# Altium schematic sheet Schema1.SchDoc: Olimex interface board
size A4; DrawnBy: Coen de Boer; Engineer: Coen de Boer; Revision: 2005-H; SheetNumber: 1
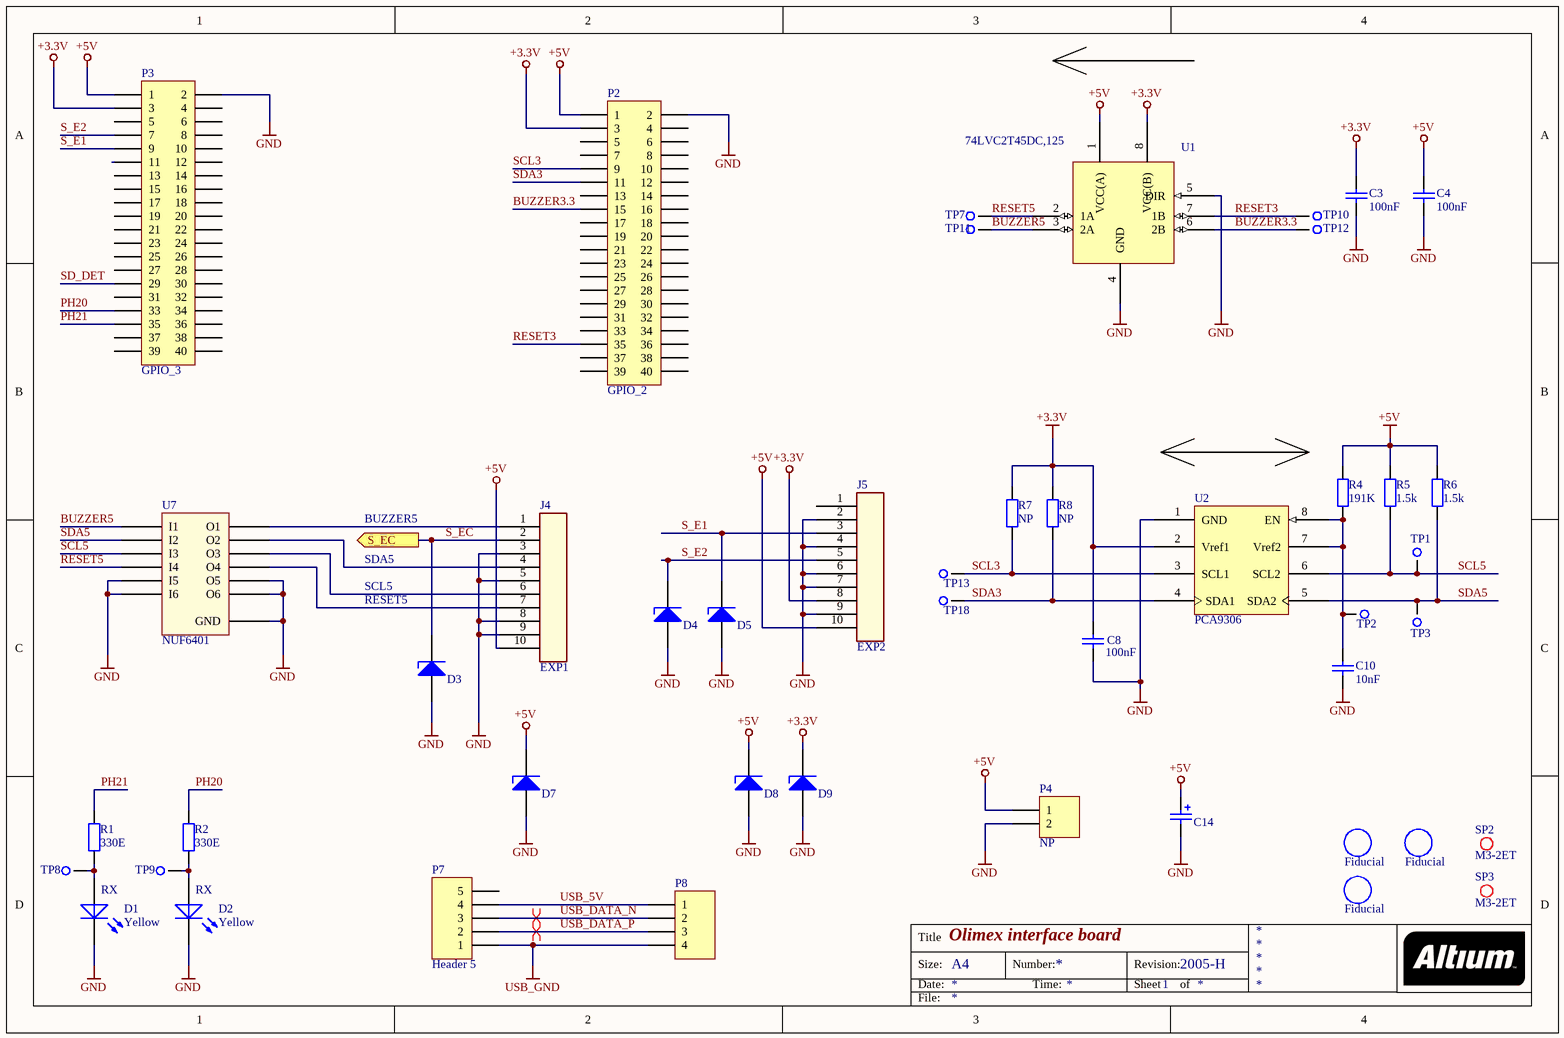
[diagram p0: Schema1.SchDoc]

## Parts
C3  100nF  [C0805 (2012)]
C4  100nF  [C0805 (2012)]
C8  100nF  [C0805 (2012)]
C10  10nF  [C0805 (2012)]
C14  470u  [CAPAE7866X80M]  (value not drawn)
D1  Yellow  [LED0805-YELLOW]
D2  Yellow  [LED0805-YELLOW]
D3  ESD9X3.3ST5G  [SODFL100X40-2N]  (value not drawn)
D4  ESD9X3.3ST5G  [SODFL100X40-2N]  (value not drawn)
D5  ESD9X3.3ST5G  [SODFL100X40-2N]  (value not drawn)
D7  ESD9X5.0ST5G  [SODFL100X40-2N]  (value not drawn)
D8  ESD9X5.0ST5G  [SODFL100X40-2N]  (value not drawn)
D9  ESD9X3.3ST5G  [SODFL100X40-2N]  (value not drawn)
Fid1  Fiducial  [Fiducial 1,5mm]  (no BOM)
Fid2  Fiducial  [Fiducial 1,5mm]  (no BOM)
Fid3  Fiducial  [Fiducial 1,5mm]  (no BOM)
J4  EXP1  [BOXHEADER-10P-R/A-ST-2.54]
J5  EXP2  [BOXHEADER-10P-R/A-ST-2.54]
P2  GPIO_2  [M50-3152042]
P3  GPIO_3  [M50-3152042]
P4  NP  [HDR1X2]
P7  Header 5  [Female Header 5 pins]
P8  (no value)  [B4B-XH-A]
R1  330E  [RESC1608X05N]
R2  330E  [RESC1608X05N]
R4  191K  [R0805 (2012)]
R5  1.5k  [RESC1608X05N]
R6  1.5k  [RESC1608X05N]
R7  NP  [R0805 (2012)]
R8  NP  [R0805 (2012)]
SP2  M3-2ET  [SPACER M3-4ET]
SP3  M3-2ET  [Spacer M3-4ETkleinepad]
TP1  2mm  [TESTPOINT 2mm]  (value not drawn)  (no BOM)
TP2  2mm  [TESTPOINT 2mm]  (value not drawn)  (no BOM)
TP3  2mm  [TESTPOINT 2mm]  (value not drawn)  (no BOM)
TP7  2mm  [TESTPOINT 2mm]  (value not drawn)  (no BOM)
TP8  2mm  [TESTPOINT 2mm]  (value not drawn)  (no BOM)
TP9  2mm  [TESTPOINT 2mm]  (value not drawn)  (no BOM)
TP10  2mm  [TESTPOINT 2mm]  (value not drawn)  (no BOM)
TP11  2mm  [TESTPOINT 2mm]  (value not drawn)  (no BOM)
TP12  2mm  [TESTPOINT 2mm]  (value not drawn)  (no BOM)
TP13  2mm  [TESTPOINT 2mm]  (value not drawn)  (no BOM)
TP18  2mm  [TESTPOINT 2mm]  (value not drawn)  (no BOM)
U1  74LVC2T45DC,125  [TSSOP50P310X100-8N]
U2  PCA9306  [IC SSOP-8]
U7  NUF6401  [SON50P140X100_HS-13N]

## Ports
S_EC (out)

## Nets
+3.3V: C3.1 C8.2 D9.1(K) J5.8 P2.3 P3.3 R7.2 R8.2 U1.8(VCC(B)) U2.2(Vref1)
+5V: C4.1 C14.1 D7.1(K) D8.1(K) J4.10 J5.10 P2.1 P3.1 P4.1 R4.2 R5.2 R6.2 U1.1(VCC(A))
GND: C3.2 C4.2 C8.1 C10.1 C14.2 D1.2(K) D2.2(K) D3.2(A) D4.2(A) D5.2(A) D7.2(A) D8.2(A) D9.2(A) J4.3 J4.5 J4.8 J4.9 J5.2 J5.4 J5.6 J5.7 J5.9 P2.2 P3.2 P4.2 U1.4(GND) U1.5(DIR) U2.1(GND) U7.5(I5) U7.6(I6) U7.7(O6) U7.8(O5) U7.13(GND)
USB_GND: P7.1 P8.4
BUZZER3.3: P2.15 TP12.1 U1.6(2B)
BUZZER5: TP11.1 U1.3(2A) U7.1(I1)
PH20: P3.33 R2.2
PH21: P3.35 R1.2
RESET3: P2.35 TP10.1 U1.7(1B)
RESET5: TP7.1 U1.2(1A) U7.4(I4)
S_E1: D5.1(K) J5.3 P3.9
S_E2: D4.1(K) J5.5 P3.7
S_EC: D3.1(K) J4.2 ; port S_EC
SCL3: P2.9 R7.1 TP13.1 U2.3(SCL1)
SCL5: R5.1 TP1.1 U2.6(SCL2) U7.3(I3)
SD_DET: P3.29
SDA3: P2.11 R8.1 TP18.1 U2.4(SDA1)
SDA5: R6.1 TP3.1 U2.5(SDA2) U7.2(I2)
USB_5V: P7.4 P8.1
USB_DATA_N: P7.3 P8.2
USB_DATA_P: P7.2 P8.3
NetC10_2: C10.2 R4.1 TP2.1 U2.7(Vref2) U2.8(EN)
NetD1_1: D1.1(A) R1.1 TP8.1
NetD2_1: D2.1(A) R2.1 TP9.1
NetJ4_1: J4.1 U7.12(O1)
NetJ4_4: J4.4 U7.11(O2)
NetJ4_6: J4.6 U7.10(O3)
NetJ4_7: J4.7 U7.9(O4)

Not connected (* = marked no-connect by the designer): J5 1; P2 4 5 6 7 8 10 12 13 14 16 17 18 19 20 21 22 23 24 25 26 27 28 29 30 31 32 33 34 36 37 38 39 40; P3 4 5 6 8 10 11 12 13 14 15 16 17 18 19 20 21 22 23 24 25 26 27 28 30 31 32 34 36 37 38 39 40; P7 5

## Layout directives
differential pair: USB_DATA_N, USB_DATA_P

## Notes on the sheet
- BUZZER5
- SDA5
- SCL5
- RESET5
- (near D1) RX
- (near D2) RX
- Title
- Size:
- Date:
- A4
- Number:
- Time:
- Revision:
- Sheet
- of
- File:

## Library data of the parts
C3 C4 C8 = Cap 100nF X7R 0805: Cap 100nF X7R 0805 10% 100V; Mfg: AVX; Mfg code: 08051C104K4T2A; Faber ItemCode: -; Max soldering temp: -; Remarks: -; Supplier: Farnell; Supplier code: 1833888; Value: 100nF; SMD: Yes
C10 = Cap 10nF X7R 0805: Cap 10nF X7R 0805 10% 100V; Mfg: AVX; Mfg code: 08051C103K4Z2A; Faber ItemCode: -; Max soldering temp: -; Remarks: -; Supplier: Farnell; Supplier code: 1833850; SMD: Yes; Value: 10nF
C14 = CAP ALUM 470UF 20% 10V SMD: Mfg: Panasonic Electronic Components; Mfg code: EEE-FTA471XAP; Capacitance: 470µF; ESR (Equivalent Series Resistance): 160 mohm @ 100kHz; Lifetime @ Temp.: 2000 Hrs @ 105°C; Polarization: Polar; Ripple Current: 390mA @ 120Hz; Surface Mount Land Size: 0.260" L x 0.260" W (6.60mm x 6.60mm); Supplier 1: Digi-Key; Supplier Part Number 1: P15094TR-ND; RoHS: RoHS Compliant; Category: Capacitors; Stock: 31500; Pricing: 900=0.22154, 1800=0.20851, 2700=0.19548, 4500=0.18244, 9000=0.17593, 22500=0.17332, 45000=0.16941, 90000=0.16615 (EUR); Packaging: Tape & Reel (TR); Tolerance: ±20%; Voltage Rating: 10V; Operating Temperature: -55°C ~ 105°C; Applications: General Purpose; Impedance: -; Lead Spacing: -; Size / Dimension: 0.248" Dia (6.30mm); Height - Seated (Max): 0.315" (8.00mm); Mounting Type: Surface Mount; Package / Case: Radial, Can - SMD; ComponentLink1URL: http://industrial.panasonic.com/cdbs/www-data/pdf/RDE0000/ABA0000C35.pdf; ComponentLink1Description: http://industrial.panasonic.com/cdbs/www-data/pdf/RDE0000/ABA0000C35.pdf
D1 D2 = Library_LED-0003: RO LED GEEL HSMY-C170 0805  AVAGO; Faber ItemCode: 35160800; ID: Library_LED-0003; Mfg: AVAGO; Mfg code: HSMY-C170; Value: Yellow
D3-D5 D9 = ESD9X3.3ST5G: TVS DIODE 3.3VWM 10.4VC SOD923; Mfg: ON Semiconductor; Type: Zener; Unidirectional Channels: 1; Voltage - Reverse Standoff (Typ): 3.3V (Max); Voltage - Breakdown (Min): 5V; Voltage - Clamping (Max) @ Ipp: 10.4V; Current - Peak Pulse (10/1000µs): 9.8A (8/20µs); Power - Peak Pulse: 102W; Power Line Protection: No; Capacitance @ Frequency: 80pF @ 1MHz; Supplier 1: Digi-Key; Supplier Part Number 1: ESD9X3.3ST5GOSTR-ND; Mfg code: ESD9X3.3ST5G; RoHS: RoHS Compliant; Category: Circuit Protection; Stock: 136000; Pricing: 8000=0.03287, 16000=0.02794, 24000=0.02629, 56000=0.02465, 200000=0.02136 (EUR); Packaging: Tape & Reel (TR); Bidirectional Channels: -; Applications: Automotive; Operating Temperature: -55°C ~ 150°C (TJ); Mounting Type: Surface Mount; Package / Case: SOD-923; Supplier Device Package: SOD-923; ComponentLink1URL: http://www.onsemi.com/pub_link/Collateral/ESD9X3.3ST5G-D.PDF; ComponentLink1Description: http://www.onsemi.com/pub_link/Collateral/ESD9X3.3ST5G-D.PDF
D7 D8 = ESD9X5.0ST5G: TVS DIODE 5VWM 12.3VC SOD923; Mfg: ON Semiconductor; Type: Zener; Unidirectional Channels: 1; Voltage - Reverse Standoff (Typ): 5V (Max); Voltage - Breakdown (Min): 6.2V; Voltage - Clamping (Max) @ Ipp: 12.3V; Current - Peak Pulse (10/1000µs): 8.7A (8/20µs); Power - Peak Pulse: 107W; Power Line Protection: No; Capacitance @ Frequency: 65pF @ 1MHz; Supplier 1: Digi-Key; Supplier Part Number 1: ESD9X5.0ST5GOSTR-ND; Mfg code: ESD9X5.0ST5G; RoHS: RoHS Compliant; Category: Circuit Protection; Stock: 40000; Pricing: 8000=0.02337, 16000=0.02032, 24000=0.01829, 56000=0.01626, 200000=0.01351 (EUR); Packaging: Tape & Reel (TR); Bidirectional Channels: -; Applications: General Purpose; Operating Temperature: -55°C ~ 150°C (TJ); Mounting Type: Surface Mount; Package / Case: SOD-923; Supplier Device Package: SOD-923; ComponentLink1URL: http://www.onsemi.com/pub_link/Collateral/ESD9X3.3ST5G-D.PDF; ComponentLink1Description: http://www.onsemi.com/pub_link/Collateral/ESD9X3.3ST5G-D.PDF
Fid1-Fid3 = Library_MISC-0003: ID: Library_MISC-0003; Faber ItemCode: -; Mfg: -; Mfg code: -; Value: Fiducial
J4 J5 = Library_CON-0019: RO CONN PR HDR BOX 10p HKS 61201021721 WUERTH; Value: BOXHEADER-10P-R/A-ST-2.54; Faber ItemCode: 36925800; ID: Library_CON-0019
P2 P3 = MHDR2X20: HARWIN - M50-3152042 - SOCKET, DUAL ENTRY, SMT, 40WAY; LatestRevisionDate: 17-Jul-2002; LatestRevisionNote: Re-released for DXP Platform.; Publisher: Altium Limited; Farnell code:: 1189109; Mfg: Harwin; Mfg code: M50-3152042; Supplier: Farnell; Supplier code: 1189109
P4 = Header 2: LatestRevisionDate: 17-Jul-2002; LatestRevisionNote: Re-released for DXP Platform.; Publisher: Altium Limited
P7 = Header 5: Header, 5-Pin; Mfg: Multicomp; Mfg code: 2212S-05SG-85
P8 = Header 4: Header, 4-Pin; Mfg: JST (JAPAN SOLDERLESS TERMINALS); Mfg code: B4B-XH-A (LF)(SN); LatestRevisionDate: 17-Jul-2002; LatestRevisionNote: Re-released for DXP Platform.; Publisher: Altium Limited; Farnell code: 1516278
R1 R2 = 330E/0603: RES 330 OHM 1/10W 1% 0603 SMD; Manufacturer: Vishay Dale; Manufacturer Part Number: CRCW0603330RFKEA; VALUE: 10; Resistance (Ohms): 330; Power (Watts): 0.1W, 1/10W; Temperature Coefficient: ±100ppm/°C; Supplier 1: Digi-Key; Supplier Part Number 1: 541-330HDKR-ND; RoHS: RoHS Compliant; Category: Resistors; Stock 1: 34990; Pricing 1: 10=0.069, 50=0.037, 200=0.02135, 1000=0.01454 (EUR); Composition: Thick Film; Features: Automotive AEC-Q200 Qualified; Tolerance: ±1%; Package / Case: 0603 (1608 Metric); Supplier Device Package: 0603 (1608 Metric); Size / Dimension: 0.061" L x 0.033" W (1.55mm x 0.85mm); Height: 0.020" (0.50mm); Number of Terminations: 2; Packaging: Digi-Reel®; ComponentLink1URL: http://www.vishay.com/doc?20035; ComponentLink1Description: http://www.vishay.com/doc?20035; Mfg: Vishay Dale; Mfg code: CRCW0603330RFKEA; Supplier: Farnell; Supplier code: 2122302
R4 = Res 191K 0805: Res 191K 0805 1% 125mW; Mfg: VISHAY DRALORIC; Mfg code: CRCW0805191KFKEA; Faber ItemCode: -; Max soldering temp: -; Remarks: -; Supplier: Farnell; Supplier code: 2139049; Value: 191K; SMD: Yes
R5 R6 = 47k/0603: RES SMD 1.5K OHM 1% 1/10W 0603; Manufacturer: Vishay Dale; Manufacturer Part Number: CRCW06031K50FKEA; Power (Watts): 0.1W, 1/10W; Temperature Coefficient: ±100ppm/°C; Supplier 1: Digi-Key; Supplier Part Number 1: 541-1.50KHDKR-ND; RoHS: RoHS Compliant; Category: Resistors; Stock 1: 104542; Pricing 1: 1=0.1, 10=0.029, 25=0.0212, 50=0.0162, 100=0.0118, 250=0.00904, 500=0.00722, 1000=0.00532 (EUR); Packaging: Digi-Reel®; Part Status: Active; Resistance (Ohms): 1.5k; Tolerance: ±1%; Composition: Thick Film; Features: Automotive AEC-Q200; Operating Temperature: -55°C ~ 155°C; Package / Case: 0603 (1608 Metric); Supplier Device Package: 0603; Size / Dimension: 0.063" L x 0.033" W (1.60mm x 0.85mm); Height - Seated (Max): 0.020" (0.50mm); Number of Terminations: 2; Failure Rate: -; ComponentLink1URL: http://www.vishay.com/docs/20035/dcrcwe3.pdf; ComponentLink1Description: http://www.vishay.com/docs/20035/dcrcwe3.pdf
R7 R8 = Res 4.7K 0805: Res 4.7K 0805 1% 100mW; Mfg: MULTICOMP; Mfg code: MC 0.1W 0805 1% 4K7; Faber ItemCode: -; Max soldering temp: -; Remarks: -; Supplier: Farnell; Supplier code: 9333266; Value: 4.7K; SMD: Yes
SP2 SP3 = Spacer M3-10ET: MOER-SMD SMTSO-M3-2ET  PEM; Mfg: PEM; Mfg code: SMTSO-M3-2ET; Value: -; Remarks: -; Supplier: Onkenhout & Onkenhout; Supplier code: SMTSO-M3-2ET; Max soldering temp: -; SMD: Yes
TP1-TP3 TP7-TP13 TP18 = Testpoint, 2mm, round: Remarks: Not a component; Faber ItemCode: -; Mfg: -; Mfg code: -; Value: -; Supplier: -; Supplier code: -; Max soldering temp: -
U1 = 74LVC2T45DC,125: 2-bit translaing transceiver; Mfg: NXP; Mfg code: 74LVC2T45DC,125; Supplier: Farnell; Supplier code: 2444915
U2 = IC PCA9306: IC PCA9306 Voltage Level translator; Mfg: TEXAS INSTRUMENTS; Mfg code: PCA9306DCTR; Faber ItemCode: -; Max soldering temp: -; Remarks: -; SMD: Yes; Supplier: Farnell; Supplier code: 1470936; Value: -
U7 = NUF6401: Mfg: ON Semiconductor; Mfg code: NUF6401MNT1G; Filter Order: 2nd; Number of Channels: 6; Center / Cutoff Frequency: 110MHz (Cutoff); Attenuation Value: 30dB @ 800MHz ~ 3GHz; Resistance - Channel (Ohms): 100; Values: R = 100 Ohms, C = 17pF; ESD Protection: Yes; Supplier 1: Digi-Key; Supplier Part Number 1: NUF6401MNT1GOSTR-ND; RoHS: RoHS Compliant; Category: Filters; Stock: 6000; Pricing: 3000=0.13931, 6000=0.13111, 15000=0.12292, 30000=0.11472 (EUR); Packaging: Tape & Reel (TR); Type: Low Pass; Technology: RC (Pi); Current: -; Operating Temperature: -40°C ~ 85°C; Applications: Data Lines for Mobile Devices; Package / Case: 12-VFDFN Exposed Pad; Size / Dimension: 0.118" L x 0.053" W (3.00mm x 1.35mm); Height: 0.039" (1.00mm); ComponentLink1URL: http://www.onsemi.cn/pub_link/Collateral/NUF6401-D.PDF; ComponentLink1Description: http://www.onsemi.cn/pub_link/Collateral/NUF6401-D.PDF